# Altium schematic sheet 06-RP2040.SchDoc
size B; SheetNumber: 6; SheetTotal: 8
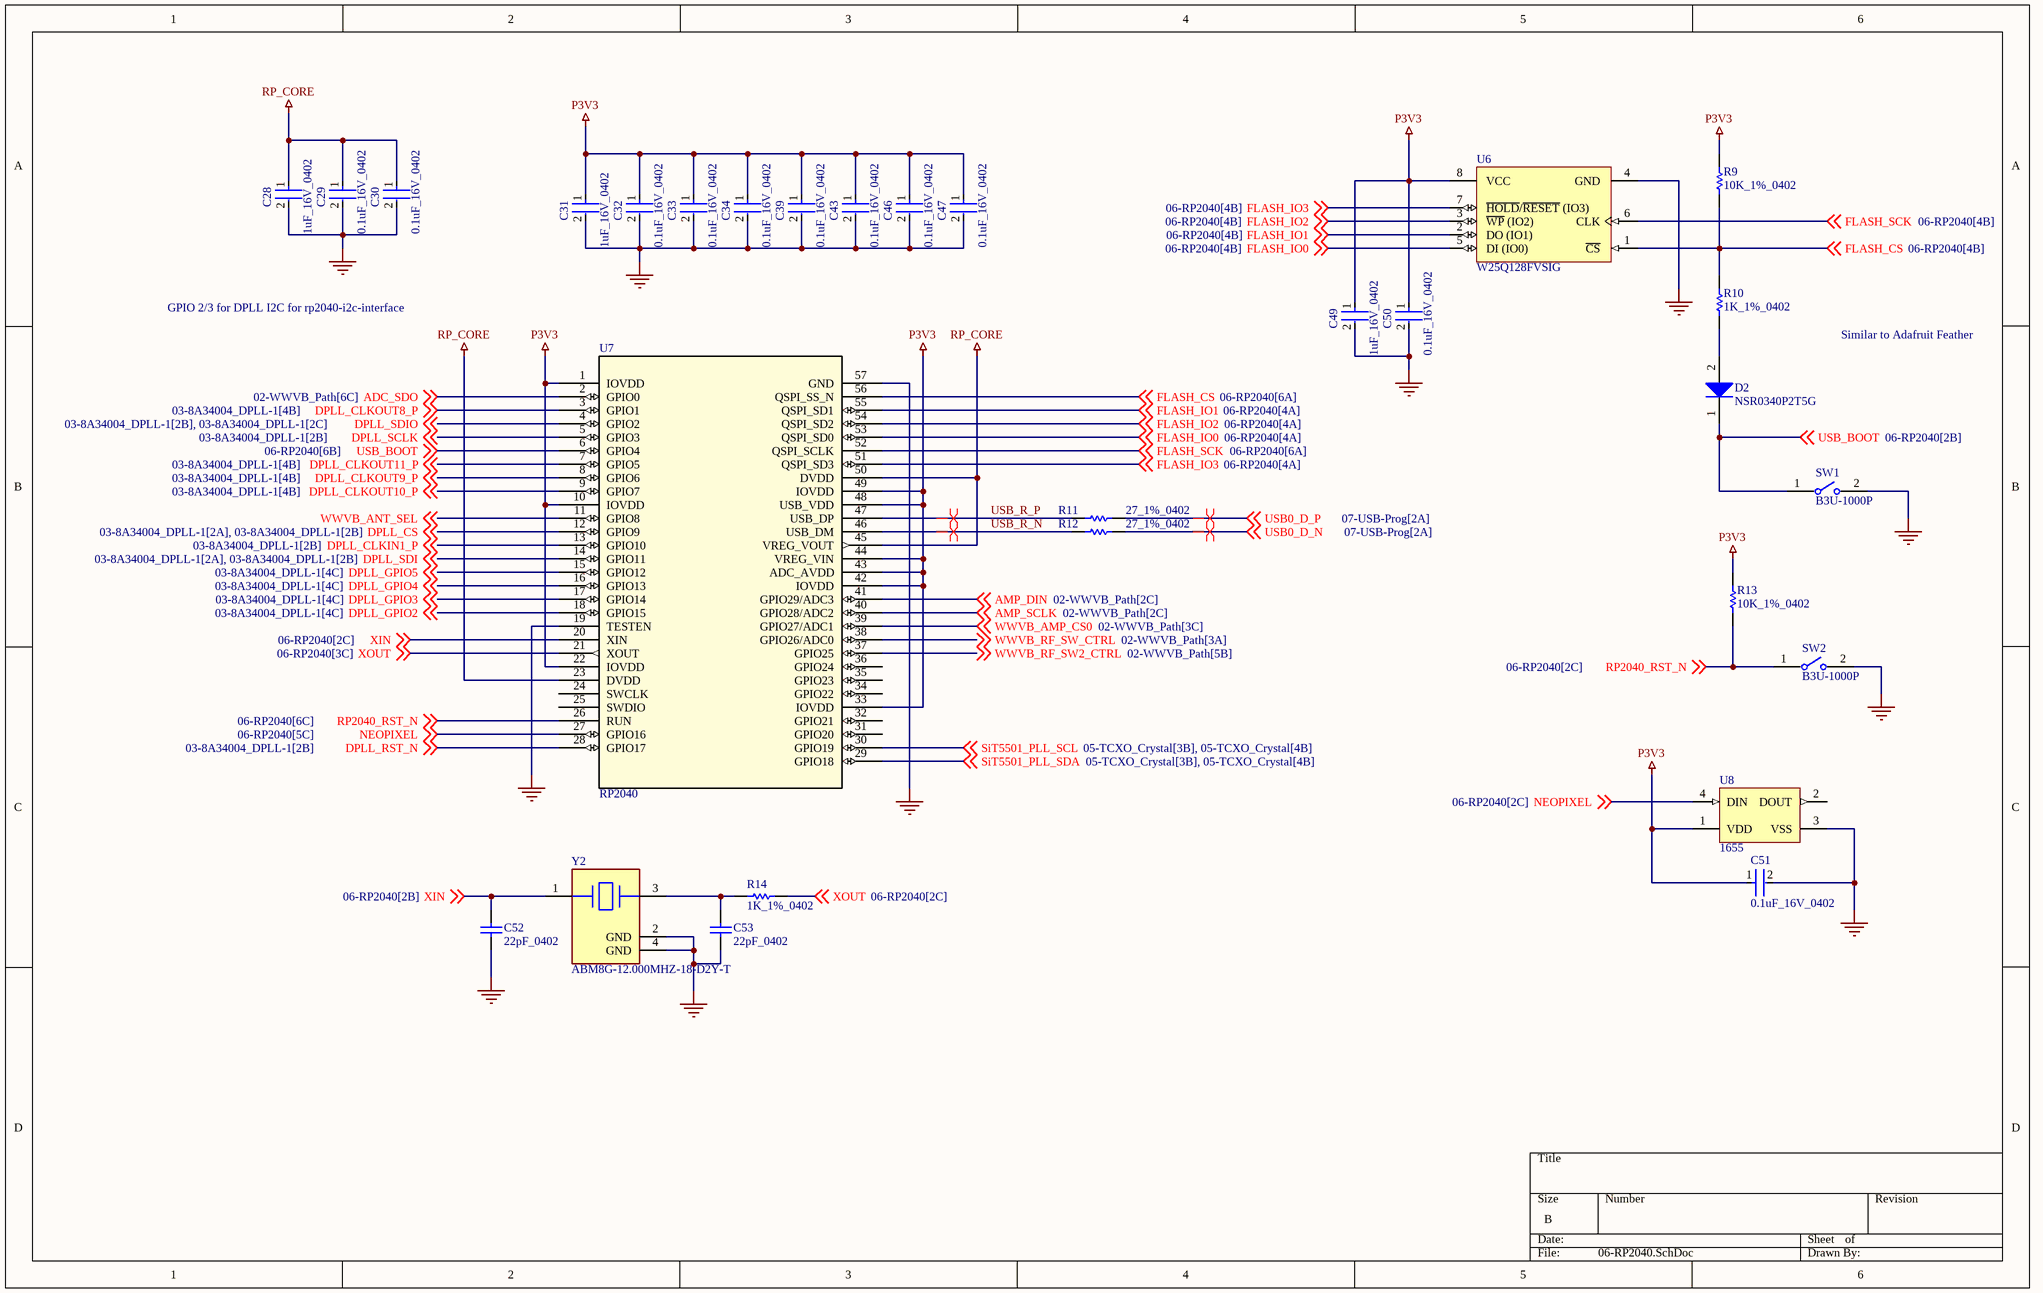
[diagram p0: 06-RP2040.SchDoc]

## Parts
C28  1uF_16V_0402  [FP-0402-L_1_0_0_05-W_0_5-IPC_A]
C29  0.1uF_16V_0402  [FP-C0402-BB-MFG]
C30  0.1uF_16V_0402  [FP-C0402-BB-MFG]
C31  1uF_16V_0402  [FP-0402-L_1_0_0_05-W_0_5-IPC_A]
C32  0.1uF_16V_0402  [FP-C0402-BB-MFG]
C33  0.1uF_16V_0402  [FP-C0402-BB-MFG]
C34  0.1uF_16V_0402  [FP-C0402-BB-MFG]
C39  0.1uF_16V_0402  [FP-C0402-BB-MFG]
C43  0.1uF_16V_0402  [FP-C0402-BB-MFG]
C46  0.1uF_16V_0402  [FP-C0402-BB-MFG]
C47  0.1uF_16V_0402  [FP-C0402-BB-MFG]
C49  1uF_16V_0402  [FP-0402-L_1_0_0_05-W_0_5-IPC_A]
C50  0.1uF_16V_0402  [FP-C0402-BB-MFG]
C51  0.1uF_16V_0402  [FP-C0402-BB-MFG]
C52  22pF_0402  [CAPC1005X55X25ML05T05]
C53  22pF_0402  [CAPC1005X55X25ML05T05]
D2  NSR0340P2T5G  [ONSC-SOD-923-2-514AB-01_B_V]
R9  10K_1%_0402  [RESC1005X40X25NL10T10]
R10  1K_1%_0402  [RESC1005X40X25LL10T10]
R11  27_1%_0402  [RESC1005X40X25LL05T10]
R12  27_1%_0402  [RESC1005X40X25LL05T10]
R13  10K_1%_0402  [RESC1005X40X25NL10T10]
R14  1K_1%_0402  [RESC1005X40X25LL10T10]
SW1  B3U-1000P  [FP-B3U-1000P-MFG]
SW2  B3U-1000P  [FP-B3U-1000P-MFG]
U6  W25Q128FVSIG  [WINB-SOIC-8_M]
U7  RP2040  [IC57_RP2040]
U8  1655  [ADA-RGB-1655_V]
Y2  ABM8G-12.000MHZ-18-D2Y-T  [FP-ABM8G-MFG]

## Nets
GND: C28.2 C29.2 C30.2 C31.2 C32.2 C33.2 C34.2 C39.2 C43.2 C46.2 C47.2 C49.2 C50.2 C51.2 C52.1 C53.1 SW1.2 SW2.2 U6.4(GND) U7.19(TESTEN) U7.57(GND) U8.3(VSS) Y2.2(GND) Y2.4(GND)
P3V3: C31.1 C32.1 C33.1 C34.1 C39.1 C43.1 C46.1 C47.1 C49.1 C50.1 C51.1 R9.1 R13.1 U6.8(VCC) U7.1(IOVDD) U7.10(IOVDD) U7.22(IOVDD) U7.33(IOVDD) U7.42(IOVDD) U7.43(ADC_AVDD) U7.44(VREG_VIN) U7.48(USB_VDD) U7.49(IOVDD) U8.1(VDD)
RP_CORE: C28.1 C29.1 C30.1 U7.23(DVDD) U7.45(VREG_VOUT) U7.50(DVDD)
ADC_SDO: U7.2(GPIO0) ; off-sheet ADC_SDO
AMP_DIN: U7.41(GPIO29/ADC3) ; off-sheet AMP_DIN
AMP_SCLK: U7.40(GPIO28/ADC2) ; off-sheet AMP_SCLK
DPLL_CLKIN1_P: U7.13(GPIO10) ; off-sheet DPLL_CLKIN1_P
DPLL_CLKOUT8_P: U7.3(GPIO1) ; off-sheet DPLL_CLKOUT8_P
DPLL_CLKOUT9_P: U7.8(GPIO6) ; off-sheet DPLL_CLKOUT9_P
DPLL_CLKOUT10_P: U7.9(GPIO7) ; off-sheet DPLL_CLKOUT10_P
DPLL_CLKOUT11_P: U7.7(GPIO5) ; off-sheet DPLL_CLKOUT11_P
DPLL_CS: U7.12(GPIO9) ; off-sheet DPLL_CS
DPLL_GPIO2: U7.18(GPIO15) ; off-sheet DPLL_GPIO2
DPLL_GPIO3: U7.17(GPIO14) ; off-sheet DPLL_GPIO3
DPLL_GPIO4: U7.16(GPIO13) ; off-sheet DPLL_GPIO4
DPLL_GPIO5: U7.15(GPIO12) ; off-sheet DPLL_GPIO5
DPLL_RST_N: U7.28(GPIO17) ; off-sheet DPLL_RST_N
DPLL_SCLK: U7.5(GPIO3) ; off-sheet DPLL_SCLK
DPLL_SDI: U7.14(GPIO11) ; off-sheet DPLL_SDI
DPLL_SDIO: U7.4(GPIO2) ; off-sheet DPLL_SDIO
FLASH_CS: R9.2 R10.2 U6.1(~{CS}) U7.56(QSPI_SS_N) ; off-sheet FLASH_CS
FLASH_IO0: U6.5(DI_(IO0)) U7.53(QSPI_SD0) ; off-sheet FLASH_IO0
FLASH_IO1: U6.2(DO_(IO1)) U7.55(QSPI_SD1) ; off-sheet FLASH_IO1
FLASH_IO2: U6.3(~{WP}_(IO2)) U7.54(QSPI_SD2) ; off-sheet FLASH_IO2
FLASH_IO3: U6.7(~{HOLD}/~{RESET}_(IO3)) U7.51(QSPI_SD3) ; off-sheet FLASH_IO3
FLASH_SCK: U6.6(CLK) U7.52(QSPI_SCLK) ; off-sheet FLASH_SCK
NEOPIXEL: U7.27(GPIO16) U8.4(DIN) ; off-sheet NEOPIXEL
RP2040_RST_N: R13.2 SW2.1 U7.26(RUN) ; off-sheet RP2040_RST_N
SiT5501_PLL_SCL: U7.30(GPIO19) ; off-sheet SiT5501_PLL_SCL
SiT5501_PLL_SDA: U7.29(GPIO18) ; off-sheet SiT5501_PLL_SDA
USB0_D_N: R12.2 ; off-sheet USB0_D_N
USB0_D_P: R11.2 ; off-sheet USB0_D_P
USB_BOOT: D2.1(K) SW1.1 U7.6(GPIO4) ; off-sheet USB_BOOT
USB_R_N: R12.1 U7.46(USB_DM)
USB_R_P: R11.1 U7.47(USB_DP)
WWVB_AMP_CS0: U7.39(GPIO27/ADC1) ; off-sheet WWVB_AMP_CS0
WWVB_ANT_SEL: U7.11(GPIO8) ; off-sheet WWVB_ANT_SEL
WWVB_RF_SW2_CTRL: U7.37(GPIO25) ; off-sheet WWVB_RF_SW2_CTRL
WWVB_RF_SW_CTRL: U7.38(GPIO26/ADC0) ; off-sheet WWVB_RF_SW_CTRL
XIN: C52.2 U7.20(XIN) Y2.1 ; off-sheet XIN
XOUT: R14.2 U7.21(XOUT) ; off-sheet XOUT
NetC53_2: C53.2 R14.1 Y2.3
NetD2_2: D2.2(A) R10.1

Not connected (* = marked no-connect by the designer): U7 24(SWCLK) 25(SWDIO) 31(GPIO20) 32(GPIO21) 34(GPIO22) 35(GPIO23) 36(GPIO24); U8 2(DOUT)

## Layout directives
differential pair: USB0_D_N, USB0_D_P, USB_R_N, USB_R_P

## Notes on the sheet
- GPIO 2/3 for DPLL I2C for rp2040-i2c-interface
- Similar to Adafruit Feather

## Library data of the parts
C28 C31 C49 = CMP-14477-000104-2: None; Tolerance: 10%; Voltage Rating: 16V; Dielectric: X5R; Capacitance: 1uF; Packaging: Tape and Reel; Depth: 0.5mm; Mount: Surface Mount; Thickness: 0.022inch; Package Quantity: 1; Min Operating Temperature: -55°C; Series: M; Voltage Rating (DC): 16V; Termination: SMD/SMT; Case/Package: 0402; Number of Pins: 2; Case Code (Imperial): 0402; Length: 1mm; Halogen Free: Halogen Free; Case Code (Metric): 1005; Width: 0.02inch; RoHS Compliant: Yes; Radiation Hardening: No; Max Operating Temperature: 85°C; Height: 0.5mm; Construction: Flat
C29 C30 C32-C34 C39 C43 C46 C47 C50 C51 = CMP-1034-02068-3: CAP CER 0.1UF 16V 5% X7R 0402; Manufacturer: Kemet; Manufacturer Part Number: C0402C104J4RACTU; Value: 0.10 μF; Temperature Coefficient: 15%; Tolerance: 0.05; Material: Ceramic; ComponentLink2URL: https://content.kemet.com/datasheets/KEM_C1002_X7R_SMD.pdf; Automotive: No; Device Class L2: Capacitors; Temperature: -55°C to +125°C; RoHS: TRUE; Voltage Rating: 16 V; ComponentLink2Description: Datasheet; Device Class L3: Ceramic Capacitors; Temperature Range Low: -55°C; Ipc Land Pattern Name: CAPC10050X50; Device Class L1: Passive Components; Temperature Range High: +125°C; Package: C0402-BB; Capacitance: 0.10 μF; Category: Cap; Mouser Description: CAP CER 0.1UF 16V X7R 0402; Height: 0.55mm; Digikey Description: CAP CER 0.1UF 16V 5% X7R 0402; Octopart: https://octopart.com/c0402c104j4ractu-kemet-12573893; Temperature Characteristic: X7R; Lead Free: Yes
C52 C53 = CMP-2100-03590-1: Chip Capacitor, 22 pF, +/- 5%, 50 V, -55 to 125 degC, 0402 (1005 Metric), RoHS, Tape and Reel; Manufacturer: Yageo; Voltage Rating: 50V; Dielectric Material: Ceramic; Capacitance: 22pF; Temperature Coefficient: 30ppm/degC; Dielectric: C0G; Insulation Resistance: 100GR; Datasheet URL: http://www.yageo.com/NewPortal/yageodocoutput?fileName=/pdf/MLCC/UPY-GP_NP0_16V-to-50V_14.pdf; Depth: 0.5mm; Number of Pins: 2; Height: 0.5mm; Min Operating Temperature: -55degC; REACH SVHC: NoSVHC; Max Operating Temperature: 125degC; Voltage Rating (DC): 50V; Composition: Ceramic; Packaging: TapeandReel; Package Quantity: 1; Package Reference: 0402; Length: 1mm; Radiation Hardening: No; Package Description: 2-Pin Surface Mount Device, Body 1 x 0.5 mm; RoHSCompliant: True; Thickness: 0.022inch; Manufacturer URL: http://www.yageo.com/; Mount: SurfaceMount; Case Code (Metric): 1005; Case/Package: 0402; Tolerance: 5%; Termination: SMD/SMT; Width: 0.02inch; Datasheet Version: Rev. 14, 07/2016; Lead Free: LeadFree; Case Code (Imperial): 0402
D2 = CMP-1055-00495-1: Schottky Barrier Diode, 2-Pin SOD-923, Pb-Free, Tape and Reel; Manufacturer: On Semiconductor; Configuration: Single; IFSM Max (A): 1; PackageReference: SOD-923-2-514AB-01_B; Mounting Technology: Surface Mount; ComponentLink2Description: Datasheet; ComponentLink2URL: http://www.onsemi.cn/pub_link/Collateral/NSR0340P2-D.PDF; DatasheetVersion: Rev. 0; ComponentLink1URL: http://www.onsemi.com/; PackageVersion: Rev. B; ComponentLink3URL: http://www.onsemi.cn/pub_link/Collateral/NSR0170P2-D.PDF; PackageDescription: 2-Pin SOD, Body 0.8 x 0.6 mm; PartNumber: NSR0340P2T5G; Packing: Tape and Reel; ComponentLink3Description: Package Specification; ComponentLink1Description: Manufacturer URL; RoHS: TRUE
R9 R13 = CMP-2002-04694-1: Manufacturer: Bourns; Part Number: CR0402-FX-1002GLF
R10 R14 = CMP-2002-04692-1: Part Number: CR0402-FX-1001GLF; Manufacturer: Bourns
R11 R12 = CMP-2002-07055-1: Part Number: RC0402FR-0727RL; Manufacturer: Yageo / Phycomp
SW1 SW2 = CMP-2100-03586-2: SWITCH TACTILE SPST-NO 0.05A 12V; Contact Resistance: 100mR; Operating Force: 1.5N; Max Current Rating: 50mA; Switch Travel: 0.15mm; Actuator Type: Standard; Mechanical Life: 200000Cycles; Ratings: Dust Proof; Illumination Type: Non-Illuminated; Throw Configuration: SPST; Actuator Length: 0.4mm; Switch Function: Off-Mom; Height: 1.2mm; Width: 3mm; Weight: 0.000776oz; Contact Material: Silver; Max Voltage Rating (DC): 12V; Insulation Resistance: 100MR; Lead Free: Lead Free; Current Rating: 50mA; Termination: SMD/SMT; Length: 4mm; Voltage Rating (DC): 12V; Contact Current Rating: 50mA; Orientation: Straight; Depth: 2.5mm; Max Operating Temperature: 70°C; Packaging: Tape and Reel; Min Operating Temperature: -25°C; Package Quantity: 1; Mount: Surface Mount; Electrical Life: 200000Cycles
U6 = CMP-2000-05005-1: 3V 128M-Bit Serial Flash Memory with Dual/Quad SPI & QPI, 2.7 to 3.6 V, -40 to 85 degC, 8-Pin SOIC, RoHS, Tape and Reel; Manufacturer: Winbond; Number of Words: 16777216; Address Bus: 24b; Word Size: 8b; Boot Type: NotRequired; Supply Current: 20mA; Operating Supply Voltage (Max): 3.6V; Sync/Async: Synchronous; Rad Hardened: No; Interface Type: Serial(SPI); Access Time (Max): 7ns; Operating Supply Voltage (Min): 2.7V; Operating Supply Voltage (Typ): 3/3.3V; Programmable: Yes; Density: 134217728Bit; Cell Type: NOR; Package Description: 8-Pin Small Outline Integrated Circuit, Body 5.28 x 5.28 mm, Pitch 1.27 mm; Datasheet URL: http://download.siliconexpert.com/pdfs/2015/11/30/6/42/17/890/win_/manual/3w25q128fv20rev.l2008242015.pdf; Package Reference: SS-8; Package Type: SOICW; Datasheet Version: Rev. L, 08/2015; Manufacturer URL: http://www.winbond.com/hq/index.html?__locale=en; Pin Count: 8; Operating Temperature Classification: Industrial; Operating Temperature (Min): -40C; Program/Erase Volt (Typ): 2.7to3.6V; Operating Temperature (Max): 85C; Mounting: SurfaceMount; Operating Temp Range: -40Cto85C
U7 = RP2040: No Description Available; Mfr_Name: Raspberry Pi; RefDes: RefDes; Type: Type
U8 = CMP-2000-05026-1: Intelligent Control LED Integrated Light Source, 3.5 to 5.3 V, -25 to 80 degC, 4-Pin SMD, RoHS, Tape and Reel; Manufacturer: Adafruit-Industries-LLC; Number of LEDs: 10; Configuration: Discrete; Utilized LED: WS2812(5050); Datasheet URL: http://datasheet.octopart.com/ADA1655-Adafruit-Industries-datasheet-32028139.pdf; Series: Neopixel; Interface: -; Package Description: 4-Pin Surface Mount Device, Body 5 x 5 mm; Color: Red,Green,Blue(RGB); Category: Optoelectronics; Controller Type: -; Package Reference: 1655; Manufacturer URL: https://www.adafruit.com/; Mounting Type: SurfaceMount; Datasheet Version: May-13; Size / Dimension: 5.00mmLx5.00mmW; Family: Addressable,Specialty
Y2 = CMP-2000-05039-3: Crystal 12MHz ±20ppm (Tol) ±30ppm (Stability) 18pF FUND 120Ω 4-Pin SMD T/R; Series Resistance: 120R; Max Operating Temperature: 85°C; Mount: Surface Mount; Width: 2.5mm; Series: ABM8G; Termination: SMD/SMT; Frequency Tolerance: 20ppm; Tolerance: 20ppm; Min Operating Temperature: -40°C; Operating Frequency: 12 MHz; Depth: 2.5mm; Load Capacitance: 18pF; Number of Pins: 4; Length: 3.2mm; Radiation Hardening: No; Frequency Stability: 30ppm; Height: 1mm; Packaging: Tape and Reel; Package Quantity: 1000; ESR (Equivalent Series Resistance): 120R; Lead Free: Lead Free; Frequency: 12MHz; Case/Package: CSMD